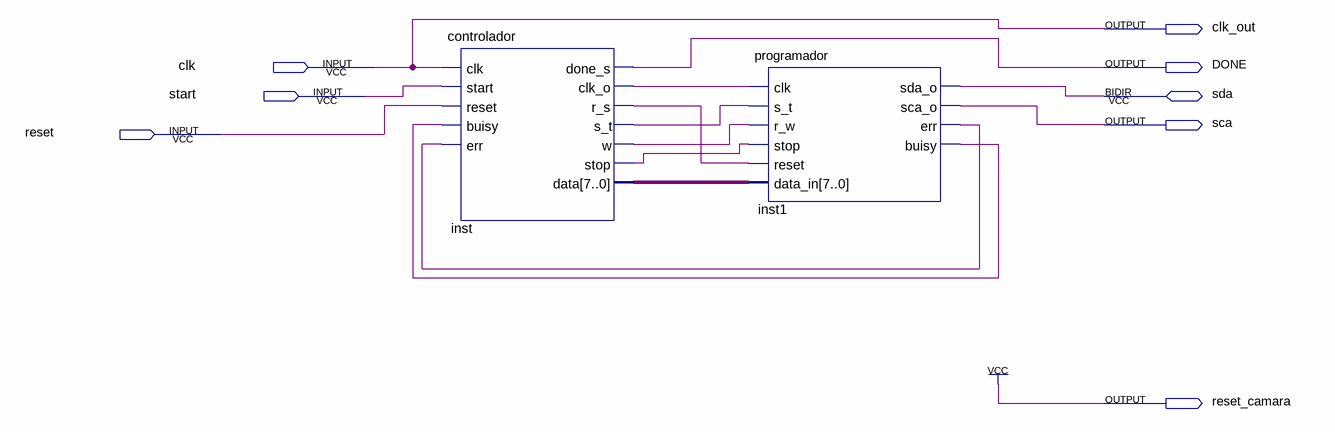
[diagram p0: schematic sheet]
// Quartus schematic Programador_controlador_block.bdf as structural Verilog: 2 symbols, 8 pins
module Programador_controlador_block (
  input  clk,
  input  start,
  input  reset,
  inout  sda,
  output clk_out,
  output DONE,
  output sca,
  output reset_camara
);

  wire inst1_buisy, inst1_err, inst_clk_o, inst_r_s, inst_s_t, inst_stop, inst_w;
  wire [7:0] inst_data;

  controlador inst (
    .clk(clk), .start(start), .reset(reset), .buisy(inst1_buisy), .err(inst1_err), .done_s(DONE),
    .clk_o(inst_clk_o), .r_s(inst_r_s), .s_t(inst_s_t), .w(inst_w), .stop(inst_stop), .data(inst_data));
  programador inst1 (
    .clk(inst_clk_o), .s_t(inst_s_t), .r_w(inst_w), .stop(inst_stop), .reset(inst_r_s), .data_in(inst_data),
    .sca_o(sca), .err(inst1_err), .buisy(inst1_buisy), .sda_o(sda));

  assign clk_out = clk;
  assign reset_camara = 1'b1;
endmodule
